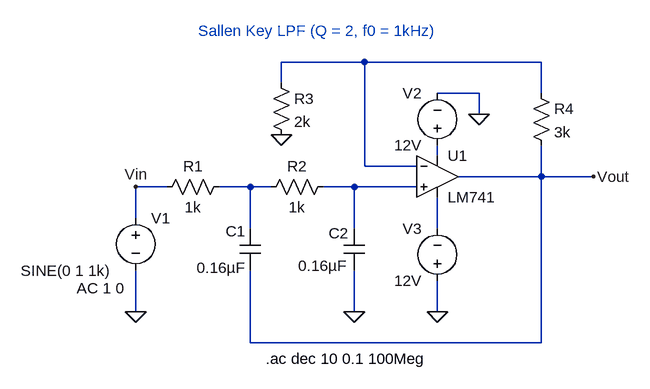
[diagram p0: schematic SallenKeyLPF.asc]
SallenKeyLPF.asc, the LTspice schematic file:
Version 4
SHEET 1 880 680
WIRE 288 -64 160 -64
WIRE 560 -64 288 -64
WIRE 160 -32 160 -64
WIRE 464 -16 400 -16
WIRE 560 -16 560 -64
WIRE 464 16 464 -16
WIRE 400 80 400 64
WIRE 288 96 288 -64
WIRE 368 96 288 96
WIRE 560 112 560 64
WIRE 560 112 432 112
WIRE 640 112 560 112
WIRE -16 128 -64 128
WIRE 112 128 64 128
WIRE 144 128 112 128
WIRE 272 128 224 128
WIRE 368 128 272 128
WIRE -64 176 -64 128
WIRE 112 192 112 128
WIRE 272 192 272 128
WIRE 400 192 400 144
WIRE -64 320 -64 256
WIRE 272 320 272 256
WIRE 400 320 400 272
WIRE 112 368 112 256
WIRE 560 368 560 112
WIRE 560 368 112 368
FLAG 272 320 0
FLAG 400 320 0
FLAG 464 16 0
FLAG -64 320 0
FLAG 160 48 0
FLAG -64 128 Vin
FLAG 640 112 Vout
SYMBOL res 80 112 R90
WINDOW 0 0 56 VBottom 2
WINDOW 3 32 56 VTop 2
SYMATTR InstName R1
SYMATTR Value 1k
SYMBOL res 240 112 R90
WINDOW 0 0 56 VBottom 2
WINDOW 3 32 56 VTop 2
SYMATTR InstName R2
SYMATTR Value 1k
SYMBOL cap 96 192 R0
WINDOW 0 -22 4 Left 2
WINDOW 3 -66 60 Left 2
SYMATTR InstName C1
SYMATTR Value 0.16µF
SYMBOL cap 256 192 R0
WINDOW 0 -23 7 Left 2
WINDOW 3 -70 57 Left 2
SYMATTR InstName C2
SYMATTR Value 0.16µF
SYMBOL OpAmps\\LM741 400 48 R0
SYMATTR InstName U1
SYMBOL voltage -64 160 R0
WINDOW 3 -177 97 Left 2
WINDOW 123 -91 124 Left 2
WINDOW 39 0 0 Left 0
SYMATTR InstName V1
SYMATTR Value SINE(0 1 1k)
SYMATTR Value2 AC 1 0
SYMBOL voltage 400 80 R180
WINDOW 0 24 96 Left 2
WINDOW 3 24 16 Left 2
SYMATTR InstName V2
SYMATTR Value 12V
SYMBOL voltage 400 288 R180
WINDOW 0 24 96 Left 2
WINDOW 3 24 16 Left 2
SYMATTR InstName V3
SYMATTR Value 12V
SYMBOL res 144 -48 R0
SYMATTR InstName R3
SYMATTR Value 2k
SYMBOL res 544 -32 R0
SYMATTR InstName R4
SYMATTR Value 3k
TEXT 32 -112 Left 2 ;Sallen Key LPF (Q = 2, f0 = 1kHz)
TEXT 136 392 Left 2 !.ac dec 10 0.1 100Meg

The netlist it stands for:
* SallenKeyLPF.asc
R1 N003 Vin 1k
R2 N004 N003 1k
C1 N003 Vout 0.16µF
C2 N004 0 0.16µF
XU1 N004 N001 N002 N005 Vout LM741  ; pins In+ In- V+ V- OUT
V1 Vin 0 SINE(0 1 1k) AC 1 0
V2 N002 0 12V
V3 0 N005 12V
R3 N001 0 2k
R4 N001 Vout 3k
* Sallen Key LPF (Q = 2, f0 = 1kHz)
.ac dec 10 0.1 100Meg
.lib LM741.lib
.backanno
.end